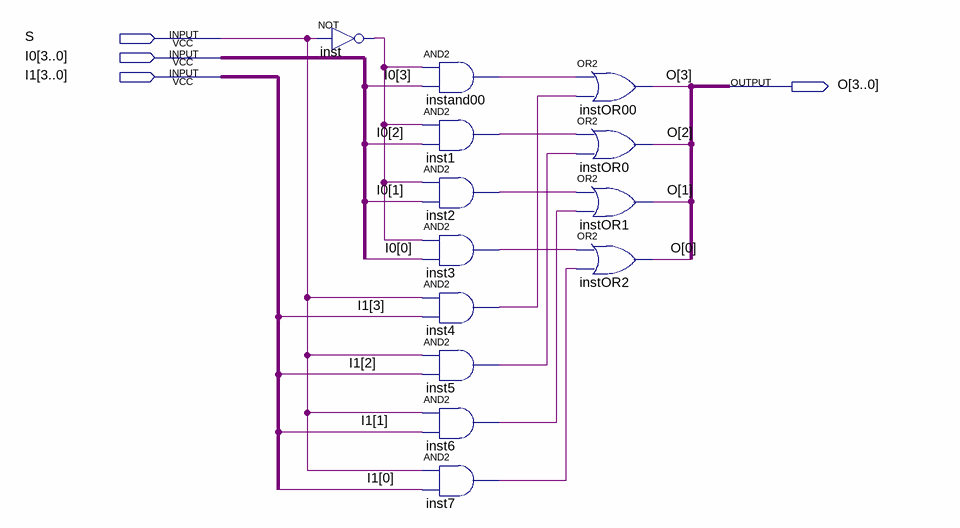
[diagram p0: schematic sheet]
// Quartus schematic Mux_4.bdf as structural Verilog: 13 symbols, 4 pins
module Mux_4 (
  input  S,
  input  [3:0] I0,
  input  [3:0] I1,
  output [3:0] O
);

  wire inst1_out, inst2_out, inst3_out, inst4_out, inst5_out, inst6_out, inst7_out, inst_out, instand00_out;

  not inst (inst_out, S);
  and instand00 (instand00_out, inst_out, I0[3]);
  and inst1 (inst1_out, inst_out, I0[2]);
  and inst2 (inst2_out, inst_out, I0[1]);
  and inst3 (inst3_out, inst_out, I0[0]);
  and inst4 (inst4_out, S, I1[3]);
  and inst5 (inst5_out, S, I1[2]);
  and inst6 (inst6_out, S, I1[1]);
  and inst7 (inst7_out, S, I1[0]);
  or instOR00 (O[3], instand00_out, inst4_out);
  or instOR0 (O[2], inst1_out, inst5_out);
  or instOR1 (O[1], inst2_out, inst6_out);
  or instOR2 (O[0], inst3_out, inst7_out);
endmodule
